# EasyEDA schematic SCH_ralay.json
TITLE: relay; REV: 1.0; Date: 2022-09-13; Sheet: 1/1; Drawn By: ChaoL9; Company: Your Company
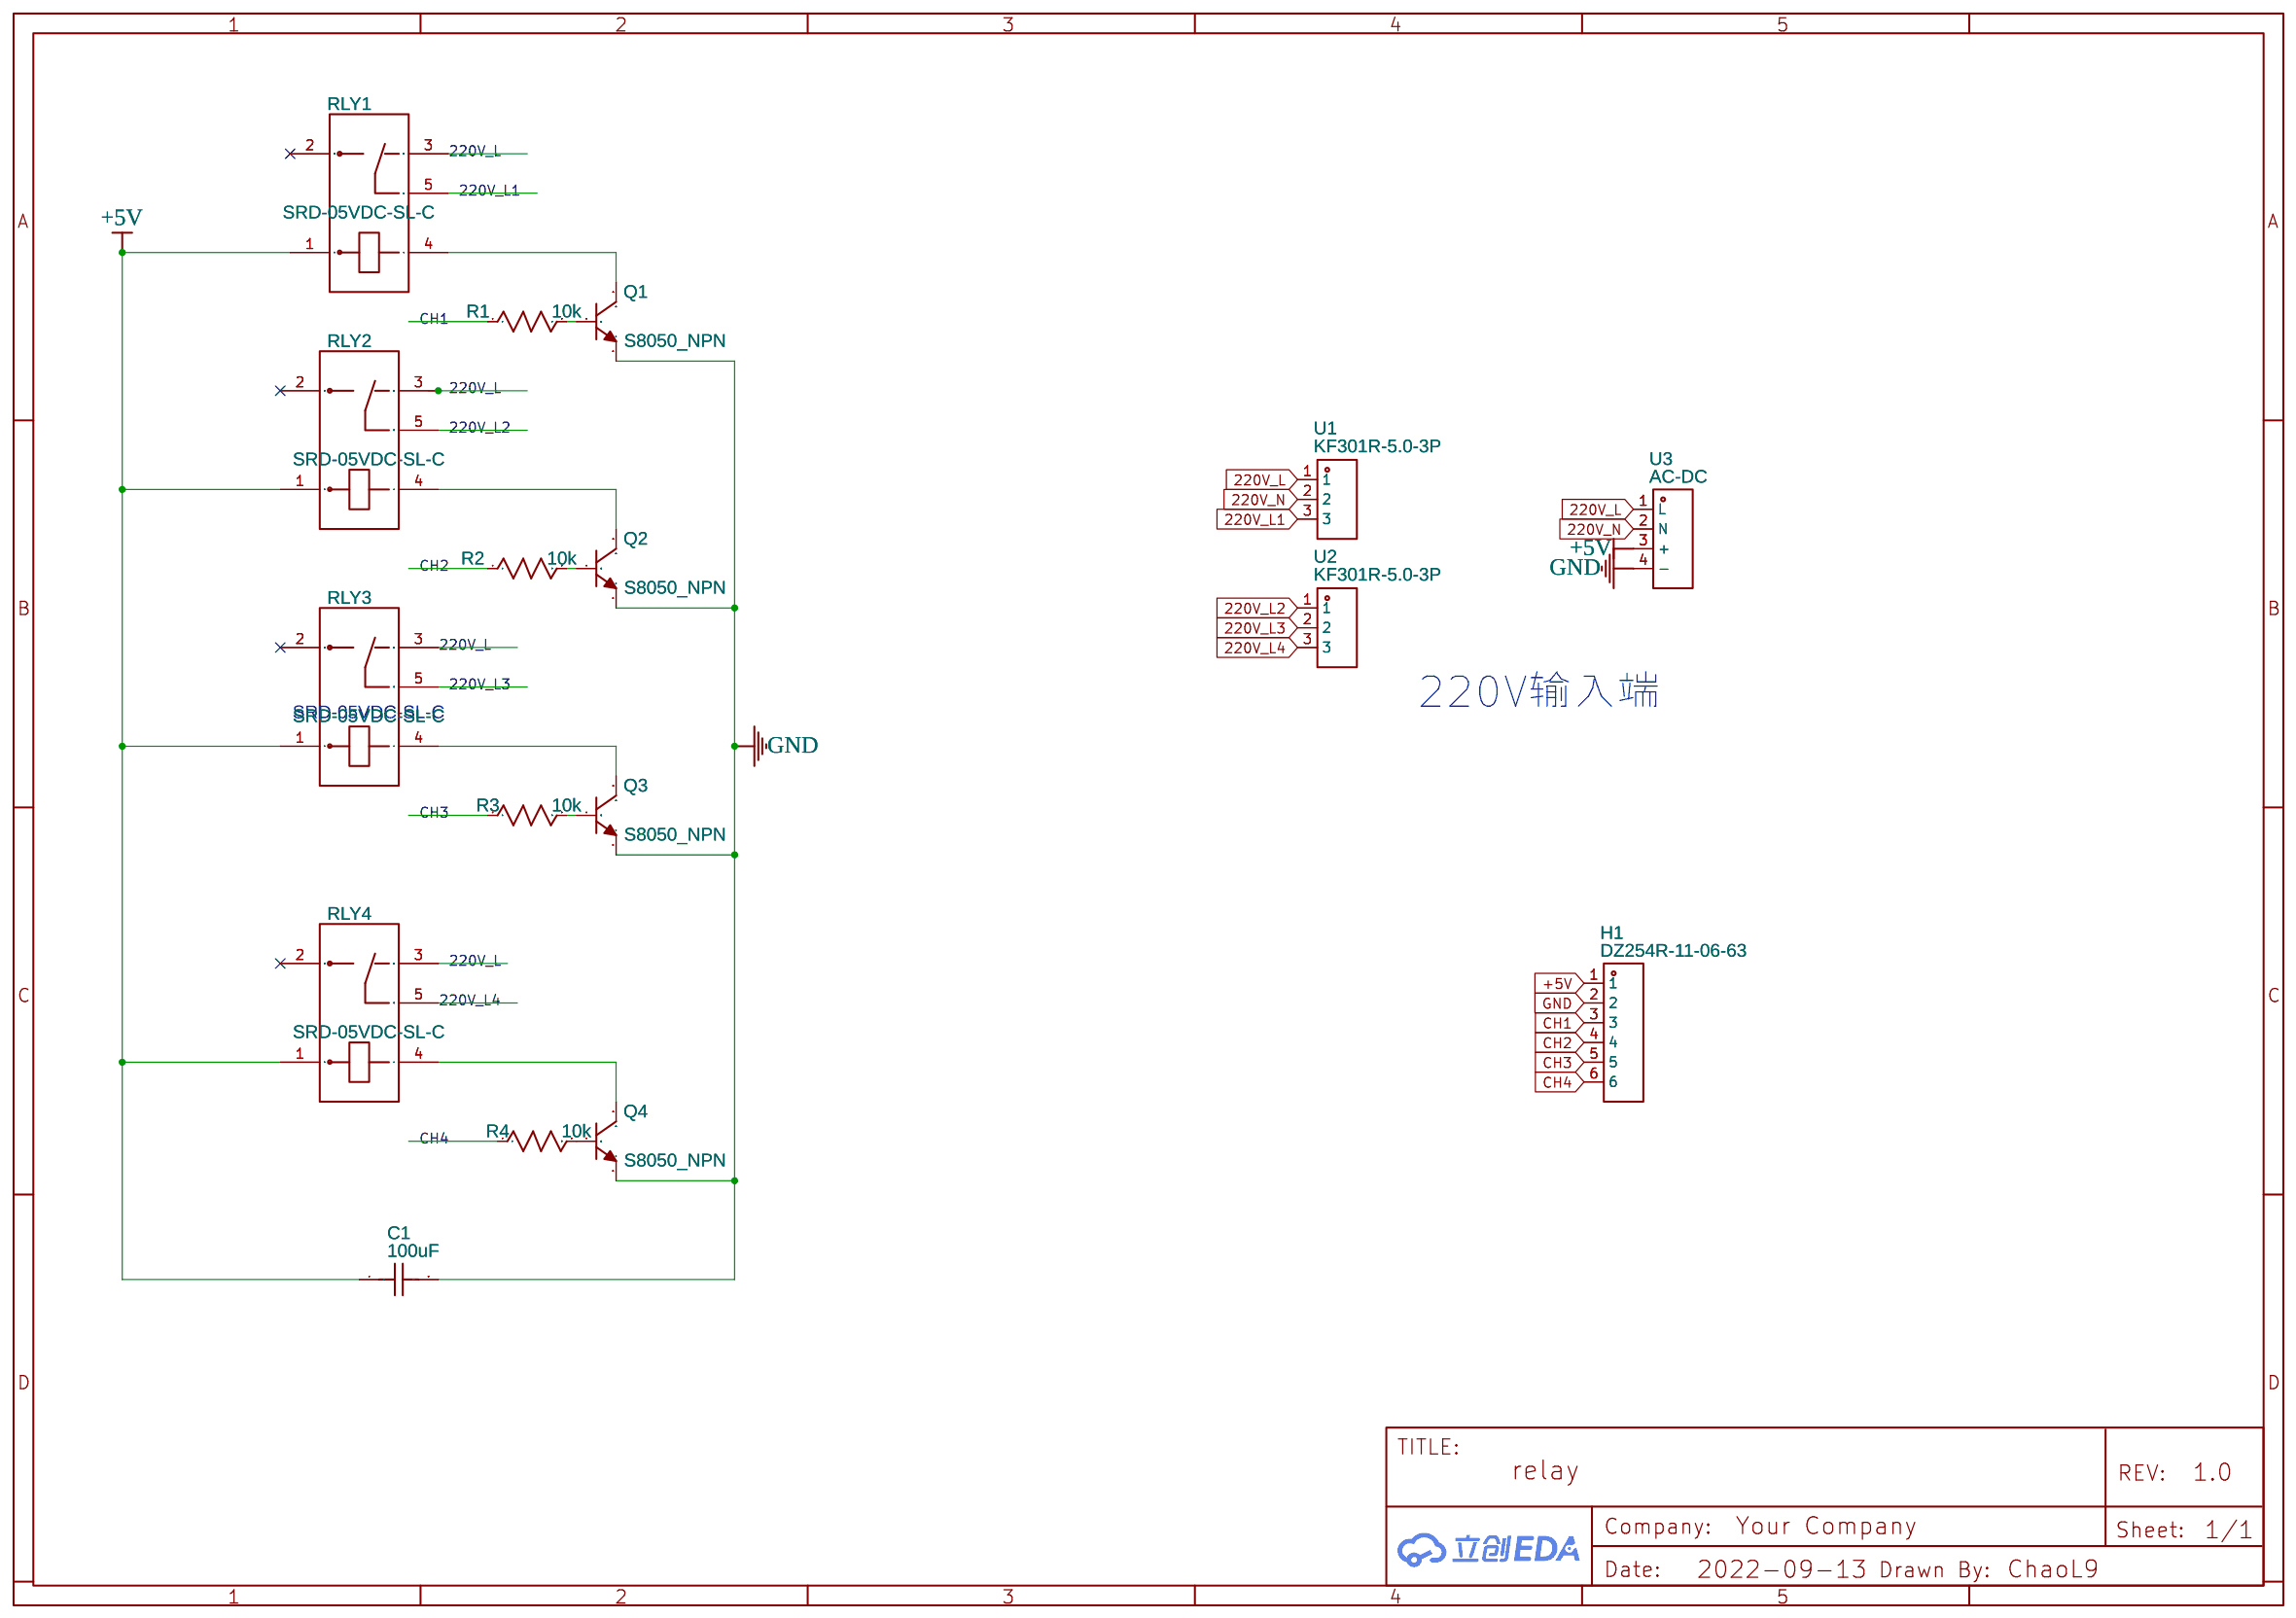
[diagram p0: schematic sheet]

## Parts
C1  100uF  [C0805]
H1  DZ254R-11-06-63  [HDR-TH_6P-P2.54-V-M]
Q1  S8050_NPN  [SOT-23-3_L2.9-W1.3-P1.90-LS2.4-BR]
Q2  S8050_NPN  [SOT-23-3_L2.9-W1.3-P1.90-LS2.4-BR]
Q3  S8050_NPN  [SOT-23-3_L2.9-W1.3-P1.90-LS2.4-BR]
Q4  S8050_NPN  [SOT-23-3_L2.9-W1.3-P1.90-LS2.4-BR]
R1  10k  [R0603]
R2  10k  [R0603]
R3  10k  [R0603]
R4  10k  [R0603]
RLY1  SRD-05VDC-SL-C  [RELAY-TH_SRD-XXVDC-XL-C]
RLY2  SRD-05VDC-SL-C  [RELAY-TH_SRD-XXVDC-XL-C]
RLY3  SRD-05VDC-SL-C  [RELAY-TH_SRD-XXVDC-XL-C]
RLY4  SRD-05VDC-SL-C  [RELAY-TH_SRD-XXVDC-XL-C]
U1  KF301R-5.0-3P  [CONN-TH_3P-P5.00]
U2  KF301R-5.0-3P  [CONN-TH_3P-P5.00]
U3  AC-DC  [AC-DC]

## Library data of the parts
C1 = GRM21BC80E107ME15L: Supplier: LCSC; Supplier Part: C2167924; Manufacturer: muRata(村田); JLCPCB Part Class: Extended Part; Contributor: lcsc
H1 = DZ254R-11-06-63: Supplier: LCSC; Supplier Part: C2935912; Manufacturer: DEALON(德艺隆); Contributor: LCSC; JLCPCB Part Class: Extended Part
Q1-Q4 = S8050_C466625: Supplier: LCSC; Supplier Part: C466625; Manufacturer: High Diode; Manufacturer Part: S8050; Contributor: LCSC
R1-R4 = R_0603_US: Contributor: LCEDA_Lib
RLY1-RLY4 = SRD-05VDC-SL-C: Supplier: LCSC; Manufacturer: SONGLE; image: //image.lceda.cn/szlcsc/C35449.jpg; Supplier Part: C35449
U1 = KF301R-5.0-3P: Supplier: LCSC; Supplier Part: C474884; Manufacturer: Cixi Kefa Elec; Contributor: LCSC; JLCPCB Part Class: Extended Part
U2 = KF301R-5.0-3P: Supplier: LCSC; Supplier Part: C474884; Manufacturer: Cixi Kefa Elec; Contributor: LCSC; JLCPCB Part Class: Extended Part; Package Display: No
U3 = AC-DC: Supplier: LCSC; Contributor: elanworld

## Nets
220V_L: RLY1.3 RLY2.3 RLY3.3 RLY4.3 U1.1 U3.1(L)
220V_L1: RLY1.5 U1.3
220V_L2: RLY2.5 U2.1
220V_L3: RLY3.5 U2.2
220V_L4: RLY4.5 U2.3
220V_N: U1.2 U3.2(N)
+5V: C1.1 H1.1 RLY1.1 RLY2.1 RLY3.1 RLY4.1 U3.3(+)
GND: C1.2 H1.2 Q1.2(E) Q2.2(E) Q3.2(E) Q4.2(E) U3.4(-)
CH1: H1.3 R1.1
CH2: H1.4 R2.1
CH3: H1.5 R3.1
CH4: H1.6 R4.1
Net-(Q1-1): Q1.1(B) R1.2
Net-(Q1-3): Q1.3(C) RLY1.4
Net-(Q2-1): Q2.1(B) R2.2
Net-(Q2-3): Q2.3(C) RLY2.4
Net-(Q3-1): Q3.1(B) R3.2
Net-(Q3-3): Q3.3(C) RLY3.4
Net-(Q4-1): Q4.1(B) R4.2
Net-(Q4-3): Q4.3(C) RLY4.4

Not connected (* = marked no-connect by the designer): RLY1 2*; RLY2 2*; RLY3 2*; RLY4 2*

## Notes on the sheet
- 220V输入端
- SRD-05VDC-SL-C
